# EAGLE design ReléDireto (EAGLE 8.2.2)
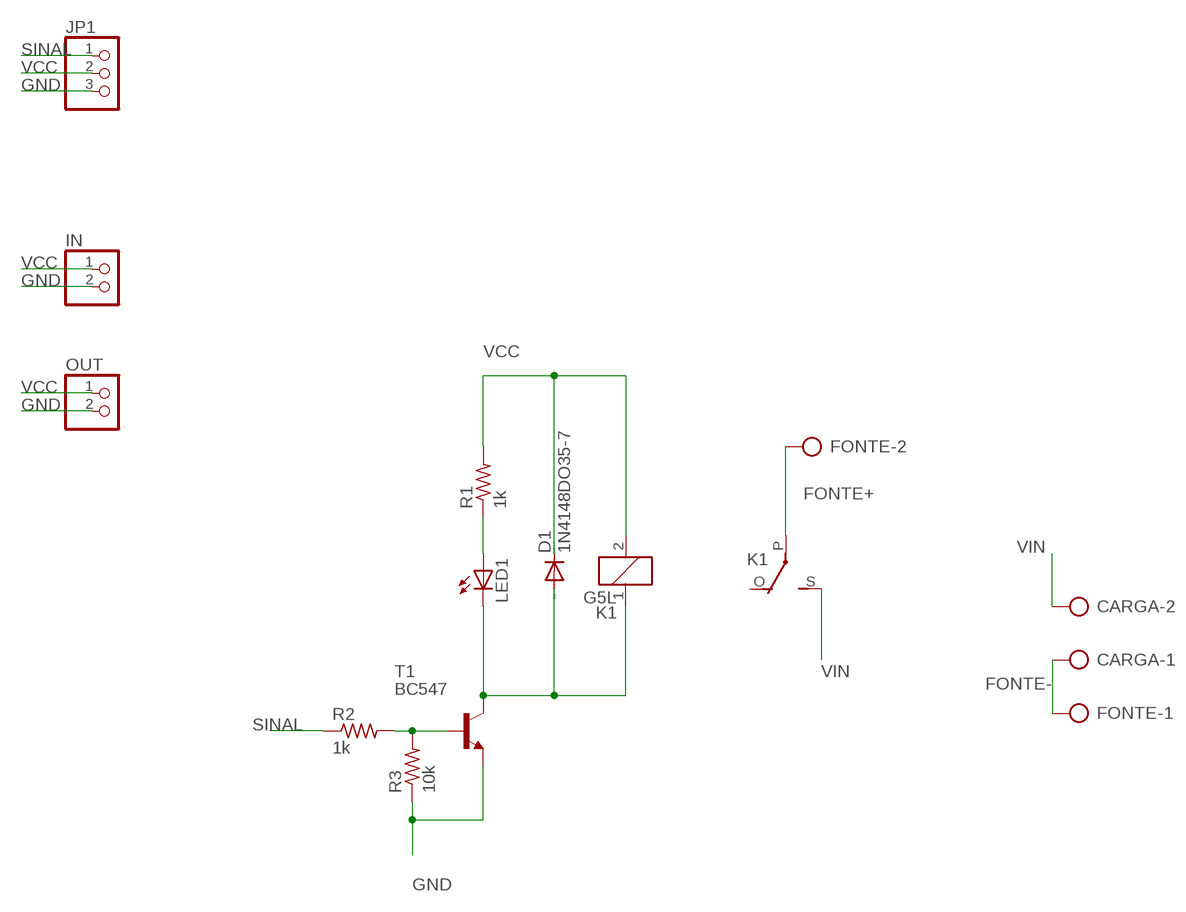
[diagram p0: schematic, sheet 1]

## Parts
CARGA  AK500/2  [AK500/2]
D1  1N4148DO35-7  [DO35-7]
FONTE  AK500/2  [AK500/2]
IN  PINHD-1X2  [1X02]
JP1  PINHD-1X3  [1X03]
K1  G5L  [G5LE]
LED1  LED5MM  [LED5MM]
OUT  PINHD-1X2  [1X02]
R1  1k  R-US_0207/7  [0207/7]
R2  1k  R-US_0207/7  [0207/7]
R3  10k  R-US_0207/7  [0207/7]
T1  BC547  [TO92]

## Nets
FONTE+: FONTE.2 K1.P(2:P)
FONTE-: CARGA.1 FONTE.1
GND: IN.2 JP1.3 OUT.2 R3.1 T1.1(E)
N$1: LED1.A R1.1
N$2: D1.A K1.1 LED1.K(C) T1.3(C)
N$3: R2.2 R3.2 T1.2(B)
SINAL: JP1.1 R2.1
VCC: D1.C IN.1 JP1.2 K1.2 OUT.1 R1.2
VIN: CARGA.2 K1.S(2:S)
Unconnected: K1.O(2:O)

## Library data of the parts
CARGA FONTE = con-ptr500:AK500/2: CONNECTOR; OC_FARNELL: unknown; OC_NEWARK: unknown
D1 = diode:1N4148: DIODE high speed (Philips)
IN OUT = pinhead:PINHD-1X2: PIN HEADER
JP1 = pinhead:PINHD-1X3: PIN HEADER
K1 = relay:G5L: RELAY 1 x switch, 10 A/120 V AC, 8 A/30 V ADC, Omron; OC_FARNELL: unknown; OC_NEWARK: unknown
LED1 = led:LED: LED OSRAM: - CHIPLED LG R971, LG N971, LY N971, LG Q971, LY Q971, LO R971, LY R971 LH N974, LH R974 LS Q976, LO Q976, LY Q976 LO Q996 - Hyper CHIPLED LW Q18S LB Q993, LB Q99A, LB R99A - SideLED LS A670, LO A670, LY A670, LG A670, LP A670 LB A673, LV A673, LT A673, LW A673 LH A674 LY A675 LS A676, LA A676, LO A676, LY A676, LW A676 LS A679, LY A679, LG A679 - Hyper Micro SIDELED® LS Y876, LA Y876, LO Y876, LY Y876 LT Y87S - SmartLED LW L88C, LW L88S LB L89C, LB L89S, LG L890 LS L89K, LO L89K, LY L89K LS L896, LA L896, LO L896, LY L896 - TOPLED LS T670, LO T670, LY T670, LG T670, LP T670 LSG T670, LSP T670, LSY T670, LOP T670, LYG T670 LG T671, LOG T671, LSG T671 LB T673, LV T673, LT T673, LW T673 LH T674 LS T676, LA T676, LO T676, LY T676, LB T676, LH T676, LSB T676, LW T676 LB T67C, LV T67C, LT T67C, LS T67K, LO T67K, LY T67K, LW E67C LS E67B, LA E67B, LO E67B, LY E67B, LB E67C, LV E67C, LT E67C LW T67C LS T679, LY T679, LG T679 LS T770, LO T770, LY T770, LG T770, LP T770 LB T773, LV T773, LT T773, LW T773 LH T774 LS E675, LA E675, LY E675, LS T675 LS T776, LA T776, LO T776, LY T776, LB T776 LHGB T686 LT T68C, LB T68C - Hyper Mini TOPLED® LB M676 - Mini TOPLED Santana® LG M470 LS M47K, LO M47K, LY M47K Source: http://www.osram.convergy.de LUXEON: - LUMILED® LXK2-PW12-R00, LXK2-PW12-S00, LXK2-PW14-U00, LXK2-PW14-V00 LXK2-PM12-R00, LXK2-PM12-S00, LXK2-PM14-U00 LXK2-PE12-Q00, LXK2-PE12-R00, LXK2-PE12-S00, LXK2-PE14-T00, LXK2-PE14-U00 LXK2-PB12-K00, LXK2-PB12-L00, LXK2-PB12-M00, LXK2-PB14-N00, LXK2-PB14-P00, LXK2-PB14-Q00 LXK2-PR12-L00, LXK2-PR12-M00, LXK2-PR14-Q00, LXK2-PR14-R00 LXK2-PD12-Q00, LXK2-PD12-R00, LXK2-PD12-S00 LXK2-PH12-R00, LXK2-PH12-S00 LXK2-PL12-P00, LXK2-PL12-Q00, LXK2-PL12-R00 Source: www.luxeon.com KINGBRIGHT: KA-3528ASYC Source: www.kingbright.com
R1-R3 = resistor:R-US_: RESISTOR, American symbol
T1 = transistor-neu-to92:BC547: NPN TRANSISTOR

## Board
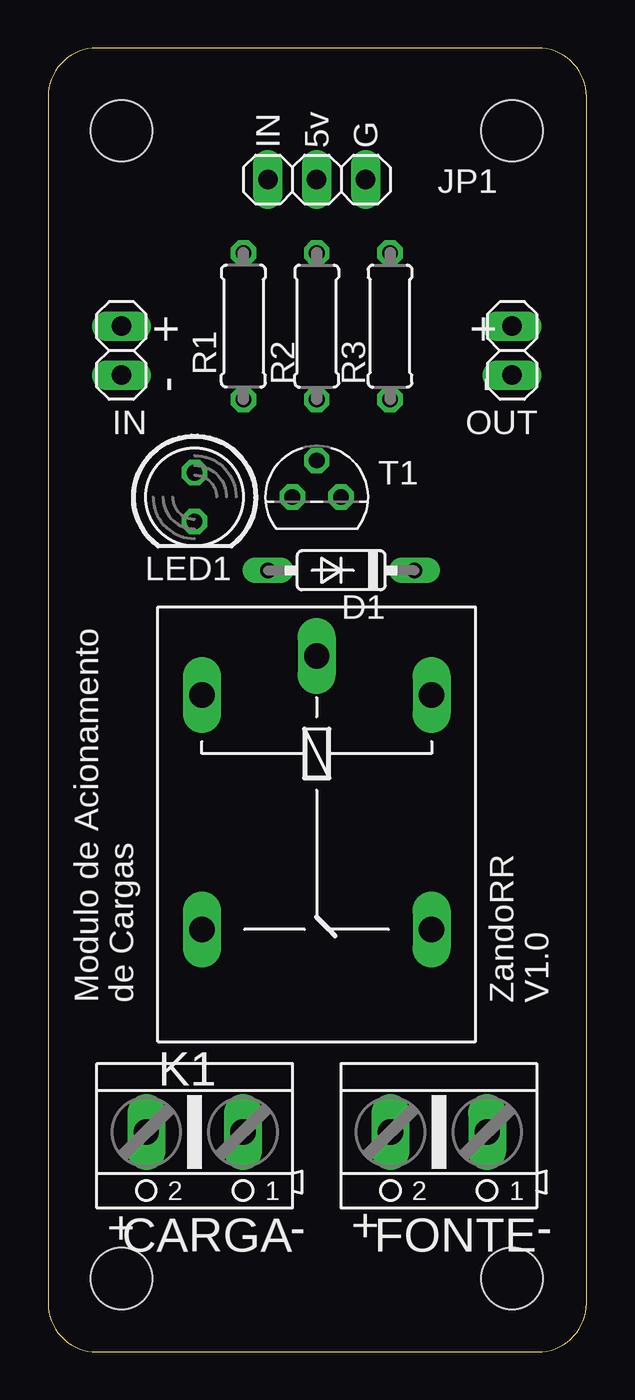
[diagram p1: board, top side]
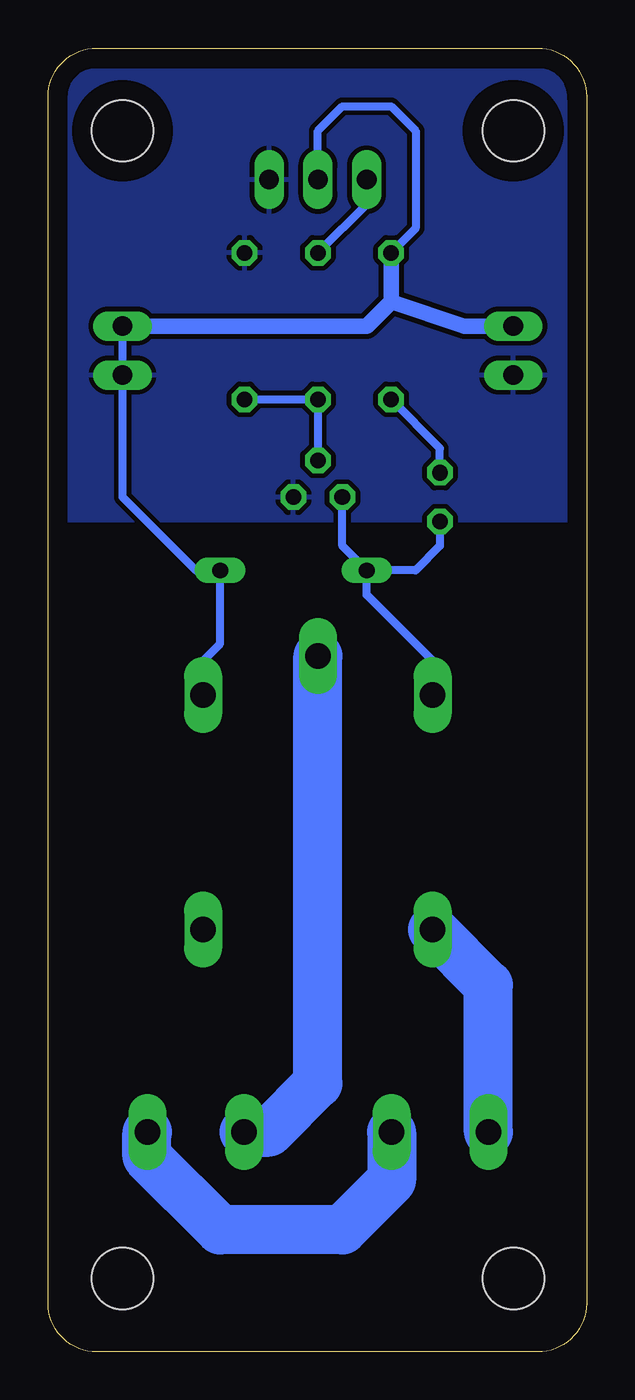
[diagram p2: board, bottom side, seen from below]

Size 28 x 67.8 mm. Coordinates in mm from the lower left corner, seen from the top.
Outline: 0,65.26 0,2.54 arc90 2.54,0 25.46,0 arc90 28,2.54 28,65.26 arc90 25.46,67.8 2.54,67.8 arc90 0,65.26
Copper layers (1*16): Top 0.035mm / dielectric 1.5mm / Bottom 0.035mm
Design rules "default": minimum track width 6mil, minimum drill 0.35mm, track to track 6mil, track to pad 6mil, pad to pad 6mil, via to via 6mil, smd to smd 6mil, copper to edge 40mil, drill to drill 6mil, minimum pad ring 10mil, minimum via ring 8mil, stop-mask expansion 4mil, vias tented up to drill 0mil, thermal gap 10mil
Holes 3.2 mm at 3.81,63.5 24.13,63.5 3.81,3.81 24.13,3.81

### Footprints (pad centres in the part's own frame; a part is rotated, then mirrored left to right if it is on the bottom)
AK500/2 = drill 1.321 long: 1 -2.515,0; 2 2.515,0
DO35-7 = drill 0.813 long: A 3.81,0; C -3.81,0
1X02 = drill 1.016 long: 1 -1.27,0; 2 1.27,0
1X03 = drill 1.016 long: 1 -2.54,0; 2 0,0; 3 2.54,0
G5LE = drill 1.321 long: 1 -7.493,-5.969; 2 -7.493,5.969; O 4.699,5.969; P -9.525,0; S 4.699,-5.969
LED5MM = drill 0.813 octagon: A -1.27,0; K 1.27,0
0207/7 = drill 0.813 octagon: 1 -3.81,0; 2 3.81,0
TO92 = drill 0.813 octagon: 1 1.27,0; 2 0,1.905; 3 -1.27,0

### Placement (x,y rotation side)
CARGA  7.62,11.43 180 top
D1  15.24,40.64 180 top
FONTE  20.32,11.43 180 top
IN  3.81,52.07 270 top
JP1  13.97,60.96 0 top
K1  13.97,26.67 270 top
LED1  7.62,44.45 270 top
OUT  24.13,52.07 270 top
R1  10.16,53.34 90 top
R2  13.97,53.34 270 top
R3  17.78,53.34 270 top
T1  13.97,44.45 0 top

### Tracks (layer width: path | path; a pad name or v marks a point on that pad's centre or on a via)
FONTE+
  Bottom 2.54: FONTE.2 16.51,11.43 13.97,13.97 K1.P
FONTE-
  Bottom 2.54: CARGA.1 10.13,8.91 12.7,6.35 19.05,6.35 22.86,10.16 22.86,11.4 FONTE.1
GND
  pour Bottom (isolate 0.254): 0,43.18 27.94,43.18 27.94,67.31 0,67.31
N$1
  Bottom 0.406: LED1.A 7.62,46.99 R1.1
N$2
  Bottom 0.406: LED1.K 7.62,41.91 8.89,40.64 D1.A | K1.1 8,35.94 11.43,39.37 D1.A | D1.A 12.7,41.91 T1.3
N$3
  Bottom 0.406: R3.2 R2.2 T1.2
SINAL
  Bottom 0.406: JP1.1 11.43,59.69 R2.1
VCC
  Bottom 0.406: K1.2 19.94,35.94 19.05,36.83 D1.C 20.32,40.64 24.13,44.45 OUT.1 | JP1.2 13.97,63.5 12.7,64.77 10.16,64.77 8.89,63.5 8.89,58.42 R1.2
  Bottom 0.813: IN.1 6.35,53.34 10.16,54.61 | R1.2 10.16,54.61 | OUT.1 11.43,53.34 10.16,54.61
VIN
  Bottom 2.54: CARGA.2 5.11,19.07 K1.S

### Text on the board
tNames: IN | 5v | G | + | + | - | - | Modulo de Acionamento / de Cargas | ZandoRR / V1.0 | + | - | + | -